# Altium schematic sheet Power.SchDoc
size A4
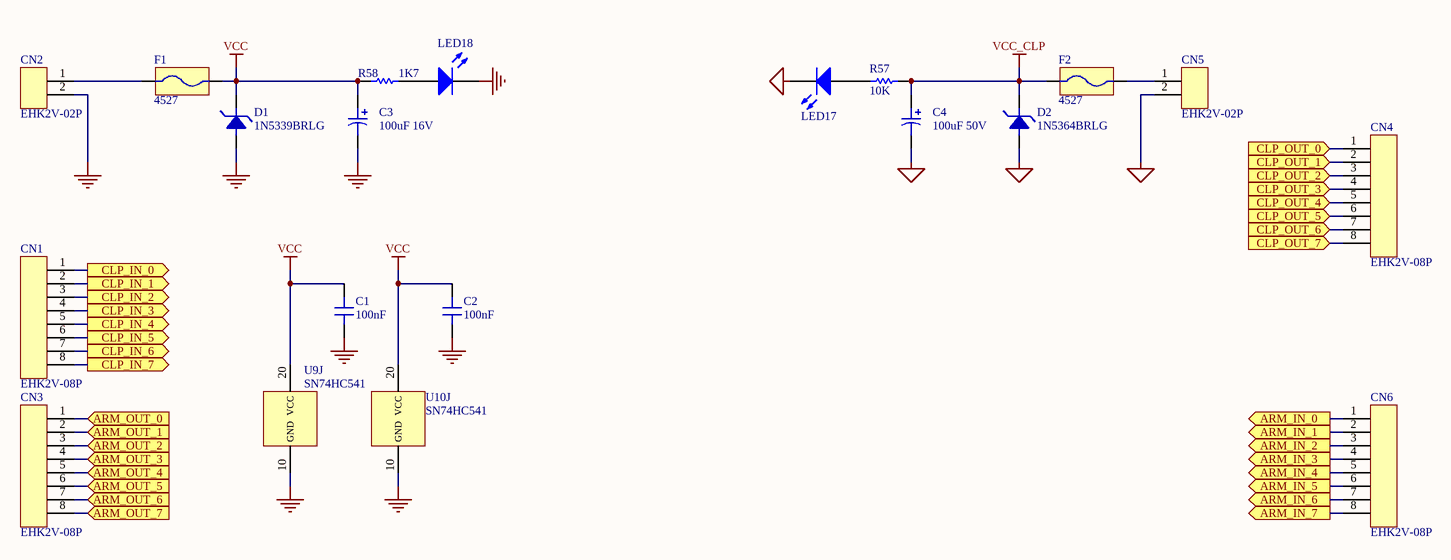
[diagram p0: Power.SchDoc]

## Parts
C1  100nF  [DiskCapacitor]
C2  100nF  [DiskCapacitor]
C3  100uF 16V  [ECA 5x11]
C4  100uF 50V  [ECA 8x11.5]
CN1  EHK2V-08P  [EHK2V-08P]
CN2  EHK2V-02P  [EHK2V-02P]
CN3  EHK2V-08P  [EHK2V-08P]
CN4  EHK2V-08P  [EHK2V-08P]
CN5  EHK2V-02P  [EHK2V-02P]
CN6  EHK2V-08P  [EHK2V-08P]
D1  1N5339BRLG  [DO-15]
D2  1N5364BRLG  [DO-15]
F1  4527  [4527]
F2  4527  [4527]
LED17  151053YS04500  [Type 5mm]  (value not drawn)
LED18  151053YS04500  [Type 5mm]  (value not drawn)
R57  value 10K  [AXIAL-0.3]  (hidden comment: Res1)
R58  value 1K7  [AXIAL-0.3]  (hidden comment: Res1)
U9  SN74HC541  [PDIP20]  (part J of 10)
U10  SN74HC541  [PDIP20]  (part J of 10)

## Ports
ARM_IN_0 (out), ARM_IN_1 (out), ARM_IN_2 (out), ARM_IN_3 (out), ARM_IN_4 (out), ARM_IN_5 (out), ARM_IN_6 (out), ARM_IN_7 (out), ARM_OUT_0 (in), ARM_OUT_1 (in), ARM_OUT_2 (in), ARM_OUT_3 (in), ARM_OUT_4 (in), ARM_OUT_5 (in), ARM_OUT_6 (in), ARM_OUT_7 (in), CLP_IN_0 (out), CLP_IN_1 (out), CLP_IN_2 (out), CLP_IN_3 (out), CLP_IN_4 (out), CLP_IN_5 (out), CLP_IN_6 (out), CLP_IN_7 (out), CLP_OUT_0 (in), CLP_OUT_1 (in), CLP_OUT_2 (in), CLP_OUT_3 (in), CLP_OUT_4 (in), CLP_OUT_5 (in), CLP_OUT_6 (in), CLP_OUT_7 (in)

## Nets
CLP_GND: C4.2 CN5.2 D2.2 LED17.1(K)
GND: C1.1 C2.1 C3.2 CN2.2 D1.2 LED18.1(K) U9.10(GND) U10.10(GND)
VCC: C1.2 C2.2 C3.1 D1.1 F1.2 R58.2 U9.20(VCC) U10.20(VCC)
VCC_CLP: C4.1 D2.1 F2.1 R57.2
ARM_IN_0: CN6.1 ; port ARM_IN_0
ARM_IN_1: CN6.2 ; port ARM_IN_1
ARM_IN_2: CN6.3 ; port ARM_IN_2
ARM_IN_3: CN6.4 ; port ARM_IN_3
ARM_IN_4: CN6.5 ; port ARM_IN_4
ARM_IN_5: CN6.6 ; port ARM_IN_5
ARM_IN_6: CN6.7 ; port ARM_IN_6
ARM_IN_7: CN6.8 ; port ARM_IN_7
ARM_OUT_0: CN3.1 ; port ARM_OUT_0
ARM_OUT_1: CN3.2 ; port ARM_OUT_1
ARM_OUT_2: CN3.3 ; port ARM_OUT_2
ARM_OUT_3: CN3.4 ; port ARM_OUT_3
ARM_OUT_4: CN3.5 ; port ARM_OUT_4
ARM_OUT_5: CN3.6 ; port ARM_OUT_5
ARM_OUT_6: CN3.7 ; port ARM_OUT_6
ARM_OUT_7: CN3.8 ; port ARM_OUT_7
CLP_IN_0: CN1.1 ; port CLP_IN_0
CLP_IN_1: CN1.2 ; port CLP_IN_1
CLP_IN_2: CN1.3 ; port CLP_IN_2
CLP_IN_3: CN1.4 ; port CLP_IN_3
CLP_IN_4: CN1.5 ; port CLP_IN_4
CLP_IN_5: CN1.6 ; port CLP_IN_5
CLP_IN_6: CN1.7 ; port CLP_IN_6
CLP_IN_7: CN1.8 ; port CLP_IN_7
CLP_OUT_0: CN4.1 ; port CLP_OUT_0
CLP_OUT_1: CN4.2 ; port CLP_OUT_1
CLP_OUT_2: CN4.3 ; port CLP_OUT_2
CLP_OUT_3: CN4.4 ; port CLP_OUT_3
CLP_OUT_4: CN4.5 ; port CLP_OUT_4
CLP_OUT_5: CN4.6 ; port CLP_OUT_5
CLP_OUT_6: CN4.7 ; port CLP_OUT_6
CLP_OUT_7: CN4.8 ; port CLP_OUT_7
NetCN2_1: CN2.1 F1.1
NetCN5_1: CN5.1 F2.2
NetLED17_2: LED17.2(A) R57.1
NetLED18_2: LED18.2(A) R58.1

## Library data of the parts
C1 C2 = Capacitor
C3 = ECA1CM101
C4 = ECA1HM101
CN1 CN3 CN4 CN6 = EHK2V-08P: PCB Terminal Blocks
CN2 CN5 = EHK2V-02P: PCB Terminal Blocks
D1 = Diode Zener: 5V6 @ 5W
D2 = Diode Zener: 33V @ 5W
F1 F2 = 4527: 5mm PC FUSE HOLDER
LED17 LED18 = CMP-1477-00001-1: THT LED round mono-color waterclear, WL-TMRW, Yellow; Manufacturer: Wuerth Elektronik; ComponentLink2URL: http://katalog.we-online.de/pbs/datasheet/7448042001.pdfhttp://katalog.we-online.de/pbs/datasheet/7448042001.pdfhttp://katalog.we-online.de/pbs/datasheet/7448042001.pdfhttp://katalog.we-online.de/pbs/datasheet/151053YS04500.pdf; Emitting color: Yellow; PackageReference: Type 5mm; ComponentLink1URL: http://www.we-online.com; PartNumber: 151053YS04500; ComponentLink2Description: Datasheet; ComponentLink1Description: Manufacturer URL
R57 R58 = Res1: Resistor; Published: 8-Jun-2000; LatestRevisionDate: 17-Jul-2002; LatestRevisionNote: Re-released for DXP Platform.; PackageReference: AXIAL-0.3; Publisher: Altium Limited; PackageDescription: Axial Device, Thru-Hole; 2 Leads; 0.3 in Pin Spacing
U9 U10 = SN74HC541: Octal Buffers and Line Drivers With 3-State Outputs